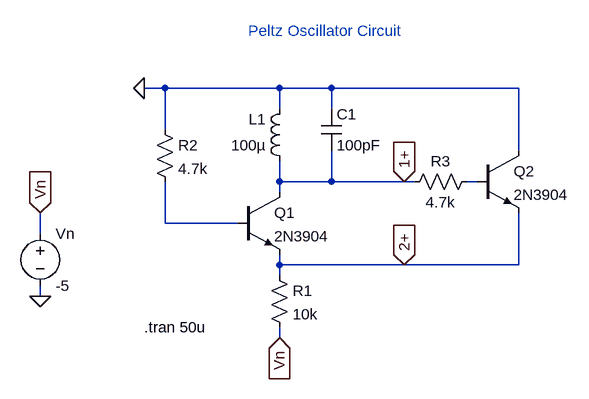
[diagram p0: schematic apltz_ltspice.asc]
apltz_ltspice.asc, the LTspice schematic file:
Version 4
SHEET 1 880 680
WIRE 0 128 -32 128
WIRE 176 128 0 128
WIRE 256 128 176 128
WIRE 544 128 256 128
WIRE 176 160 176 128
WIRE 256 160 256 128
WIRE 0 192 0 128
WIRE 544 224 544 128
WIRE 176 272 176 240
WIRE 256 272 256 224
WIRE 256 272 176 272
WIRE 368 272 256 272
WIRE 384 272 368 272
WIRE 480 272 464 272
WIRE 176 288 176 272
WIRE 0 336 0 272
WIRE 112 336 0 336
WIRE -192 352 -192 320
WIRE 176 400 176 384
WIRE 368 400 176 400
WIRE 544 400 544 320
WIRE 544 400 368 400
WIRE 176 416 176 400
WIRE -192 448 -192 432
WIRE 176 512 176 496
FLAG 368 272 1+
IOPIN 368 272 In
FLAG 368 400 2+
IOPIN 368 400 In
FLAG -32 128 0
FLAG -192 448 0
FLAG -192 320 Vn
IOPIN -192 320 In
FLAG 176 512 Vn
IOPIN 176 512 In
SYMBOL res 160 400 R0
SYMATTR InstName R1
SYMATTR Value 10k
SYMBOL res -16 176 R0
SYMATTR InstName R2
SYMATTR Value 4.7k
SYMBOL ind 192 256 R180
WINDOW 0 36 80 Left 2
WINDOW 3 36 40 Left 2
SYMATTR InstName L1
SYMATTR Value 100µ
SYMBOL cap 240 160 R0
SYMATTR InstName C1
SYMATTR Value 100pF
SYMBOL res 480 256 R90
WINDOW 0 0 56 VBottom 2
WINDOW 3 32 56 VTop 2
SYMATTR InstName R3
SYMATTR Value 4.7k
SYMBOL npn 112 288 R0
SYMATTR InstName Q1
SYMATTR Value 2N3904
SYMBOL npn 480 224 R0
SYMATTR InstName Q2
SYMATTR Value 2N3904
SYMBOL voltage -192 336 R0
SYMATTR InstName Vn
SYMATTR Value -5
TEXT 128 40 Left 2 ;Peltz Oscillator Circuit
TEXT -32 496 Left 2 !.tran 50u

The netlist it stands for:
* apltz_ltspice.asc
R1 2+ Vn 10k
R2 0 N002 4.7k
L1 1+ 0 100µ
C1 0 1+ 100pF
R3 N001 1+ 4.7k
Q1 1+ N002 2+ 0 2N3904
Q2 0 N001 2+ 0 2N3904
Vn Vn 0 -5
.model NPN NPN
.model PNP PNP
.lib standard.bjt
* Peltz Oscillator Circuit
.tran 50u
.backanno
.end